# Altium schematic sheet eps_power.SchDoc
size A4; DocumentNumber: 3; SheetNumber: 3; SheetTotal: 5
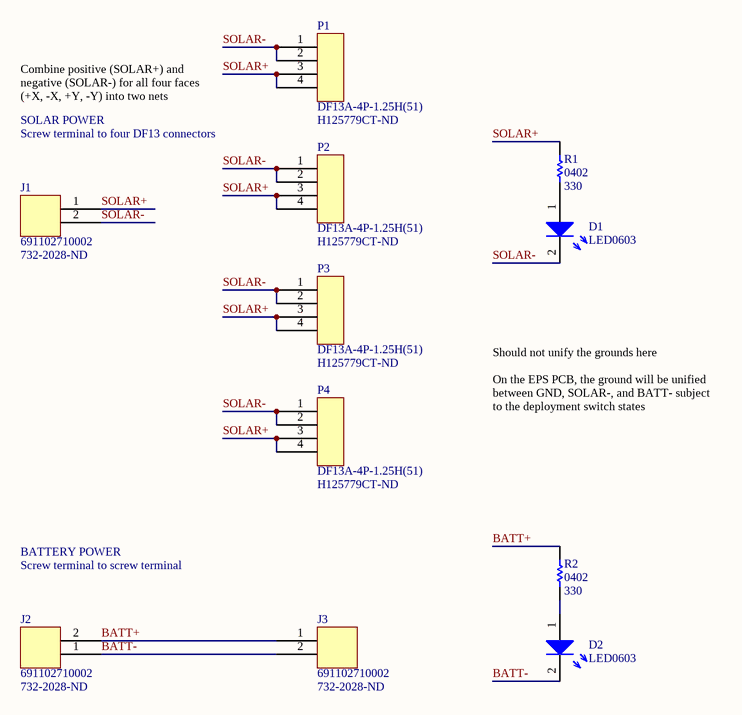
[diagram p0: eps_power.SchDoc]

## Parts
D1  LED0603  [LED0603]
D2  LED0603  [LED0603]
J1  691102710002  Supplier Part Number 1: 732-2028-ND  [CON2_SCREW_5.00MM_691102710002]
J2  691102710002  Supplier Part Number 1: 732-2028-ND  [CON2_SCREW_5.00MM_691102710002]
J3  691102710002  Supplier Part Number 1: 732-2028-ND  [CON2_SCREW_5.00MM_691102710002]
P1  DF13A-4P-1.25H(51)  Supplier Part Number 1: H125779CT-ND  [DF13A-4P-1.25H(51)]
P2  DF13A-4P-1.25H(51)  Supplier Part Number 1: H125779CT-ND  [DF13A-4P-1.25H(51)]
P3  DF13A-4P-1.25H(51)  Supplier Part Number 1: H125779CT-ND  [DF13A-4P-1.25H(51)]
P4  DF13A-4P-1.25H(51)  Supplier Part Number 1: H125779CT-ND  [DF13A-4P-1.25H(51)]
R1  0402  value 330  [RES0402R]
R2  0402  value 330  [RES0402R]

## Nets
BATT+: J2.2 J3.1 R2.2
BATT-: D2.2 J2.1 J3.2
SOLAR+: J1.1 P1.3 P1.4 P2.3 P2.4 P3.3 P3.4 P4.3 P4.4 R1.1
SOLAR-: D1.2 J1.2 P1.1 P1.2 P2.1 P2.2 P3.1 P3.2 P4.1 P4.2
NetD1_1: D1.1 R1.2
NetD2_1: D2.1 R2.1

## Notes on the sheet
- Combine positive (SOLAR+) and negative (SOLAR-) for all four faces (+X, -X, +Y, -Y) into two nets
- SOLAR POWER
- Screw terminal to four DF13 connectors
- Should not unify the grounds here
- On the EPS PCB, the ground will be unified between GND, SOLAR-, and BATT- subject to the deployment switch states
- BATTERY POWER
- Screw terminal to screw terminal

## Library data of the parts
D1 D2 = LED0603: Generic 0603 LED. Use ChipLED from Osram for generic ones.
J1-J3 = 691102710002: 2-POS screw terminal, 5mm pitch; Supplier 1: Digi-Key
P1-P4 = DF13A-4P-1.25H(51): 4 pos DF13 right angle surface mount connector; Supplier 1: Digi-Key
R1 R2 = RES0402: 0402 resistor